# EAGLE design untitled (EAGLE 7.5.0)
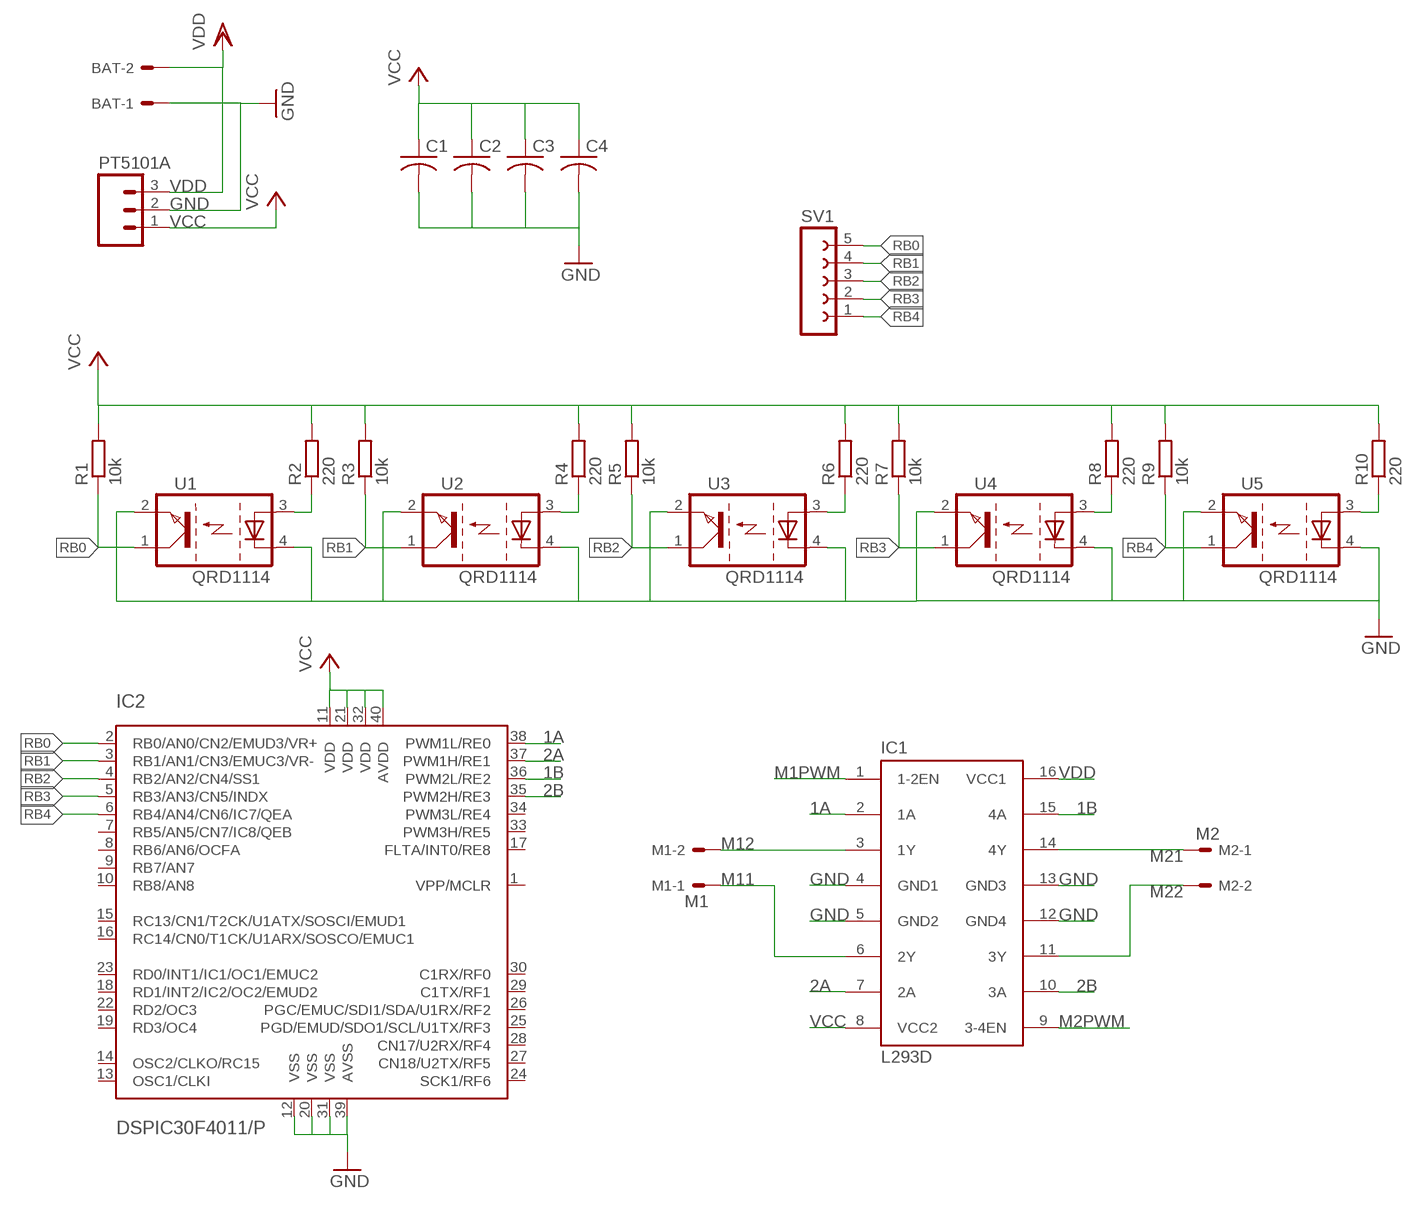
[diagram p0: schematic, sheet 1]

## Parts
BAT  22-27-2021-02  [6410-02]
C1  C-US025-024X044  [C025-024X044]
C2  C-US025-024X044  [C025-024X044]
C3  C-US025-024X044  [C025-024X044]
C4  C-US025-024X044  [C025-024X044]
IC1  L293D  [DIL16]
IC2  DSPIC30F4011/P  [DIL40]
M1  M1  22-27-2021-02  [6410-02]
M2  M2  22-27-2021-02  [6410-02]
PT5101A  M03  [03P]
R1  10k  R-EU_0204/5  [0204/5]
R2  220  R-EU_0204/5  [0204/5]
R3  10k  R-EU_0204/5  [0204/5]
R4  220  R-EU_0204/5  [0204/5]
R5  10k  R-EU_0204/5  [0204/5]
R6  220  R-EU_0204/5  [0204/5]
R7  10k  R-EU_0204/5  [0204/5]
R8  220  R-EU_0204/5  [0204/5]
R9  10k  R-EU_0204/5  [0204/5]
R10  220  R-EU_0204/5  [0204/5]
SV1  FE05-1  [FE05-1]
U1  QRD1114  [QRD1114]
U2  QRD1114  [QRD1114]
U3  QRD1114  [QRD1114]
U4  QRD1114  [QRD1114]
U5  QRD1114  [QRD1114]

## Nets
1A: IC1.2(1A) IC2.38(PWM1L/RE0)
1B: IC1.15(4A) IC2.36(PWM2L/RE2)
2A: IC1.7(2A) IC2.37(PWM1H/RE1)
2B: IC1.10(3A) IC2.35(PWM2H/RE3)
GND: BAT.1 C1.2 C2.2 C3.2 C4.2 IC1.4(GND1) IC1.5(GND2) IC1.12(GND4) IC1.13(GND3) IC2.12(VSS) IC2.20(VSS) IC2.31(VSS) IC2.39(AVSS) PT5101A.2 U1.2 U1.4 U2.2 U2.4 U3.2 U3.4 U4.2 U4.4 U5.2 U5.4
M1PWM: IC1.1(1-2EN)
M2PWM: IC1.9(3-4EN)
M11: IC1.6(2Y) M1.1
M12: IC1.3(1Y) M1.2
M21: IC1.14(4Y) M2.1
M22: IC1.11(3Y) M2.2
N$2: R2.1 U1.3
N$4: R4.1 U2.3
N$6: R10.1 U5.3
N$7: R6.1 U3.3
N$8: R8.1 U4.3
RB0: IC2.2(RB0/AN0/CN2/EMUD3/VR+) R1.1 SV1.5 U1.1
RB1: IC2.3(RB1/AN1/CN3/EMUC3/VR-) R3.1 SV1.4 U2.1
RB2: IC2.4(RB2/AN2/CN4/SS1) R5.1 SV1.3 U3.1
RB3: IC2.5(RB3/AN3/CN5/INDX) R7.1 SV1.2 U4.1
RB4: IC2.6(RB4/AN4/CN6/IC7/QEA) R9.1 SV1.1 U5.1
VCC: C1.1 C2.1 C3.1 C4.1 IC1.8(VCC2) IC2.11(VDD) IC2.21(VDD) IC2.32(VDD) IC2.40(AVDD) PT5101A.1 R1.2 R2.2 R3.2 R4.2 R5.2 R6.2 R7.2 R8.2 R9.2 R10.2
VDD: BAT.2 IC1.16(VCC1) PT5101A.3
Unconnected: IC2.1(VPP/MCLR) IC2.7(RB5/AN5/CN7/IC8/QEB) IC2.8(RB6/AN6/OCFA) IC2.9(RB7/AN7) IC2.10(RB8/AN8) IC2.13(OSC1/CLKI) IC2.14(OSC2/CLKO/RC15) IC2.15(RC13/CN1/T2CK/U1ATX/SOSCI/EMUD1) IC2.16(RC14/CN0/T1CK/U1ARX/SOSCO/EMUC1) IC2.17(FLTA/INT0/RE8) IC2.18(RD1/INT2/IC2/OC2/EMUD2) IC2.19(RD3/OC4) IC2.22(RD2/OC3) IC2.23(RD0/INT1/IC1/OC1/EMUC2) IC2.24(SCK1/RF6) IC2.25(PGD/EMUD/SDO1/SCL/U1TX/RF3) IC2.26(PGC/EMUC/SDI1/SDA/U1RX/RF2) IC2.27(CN18/U2TX/RF5) IC2.28(CN17/U2RX/RF4) IC2.29(C1TX/RF1) IC2.30(C1RX/RF0) IC2.33(PWM3H/RE5) IC2.34(PWM3L/RE4)

## Library data of the parts
BAT M1 M2 = con-molex:22-?-02: CONNECTOR wire to board 2.54 mm (.1 inch) pitch header; OC_FARNELL: unknown; OC_NEWARK: unknown
C1-C4 = rcl:C-US: CAPACITOR, American symbol
IC1 = st-microelectronics:L293D: PUSH-PULL 4 CHANNEL DRIVER; MPN: L293D; OC_FARNELL: 9589619; OC_NEWARK: 56P8249
IC2 = microchip-dspic:DSPIC30F4011: dsPIC Motion Controller DSC
PT5101A = con-amp-quick:M03: AMP QUICK CONNECTOR; OC_FARNELL: unknown; OC_NEWARK: unknown
R1-R10 = resistor:R-EU_: RESISTOR, European symbol
SV1 = con-lsta:FE05-1: FEMALE HEADER; OC_FARNELL: unknown; OC_NEWARK: unknown
U1-U5 = EYR_Sensores:QRD1114: Sensor infrarrojo QRD1114

## Board
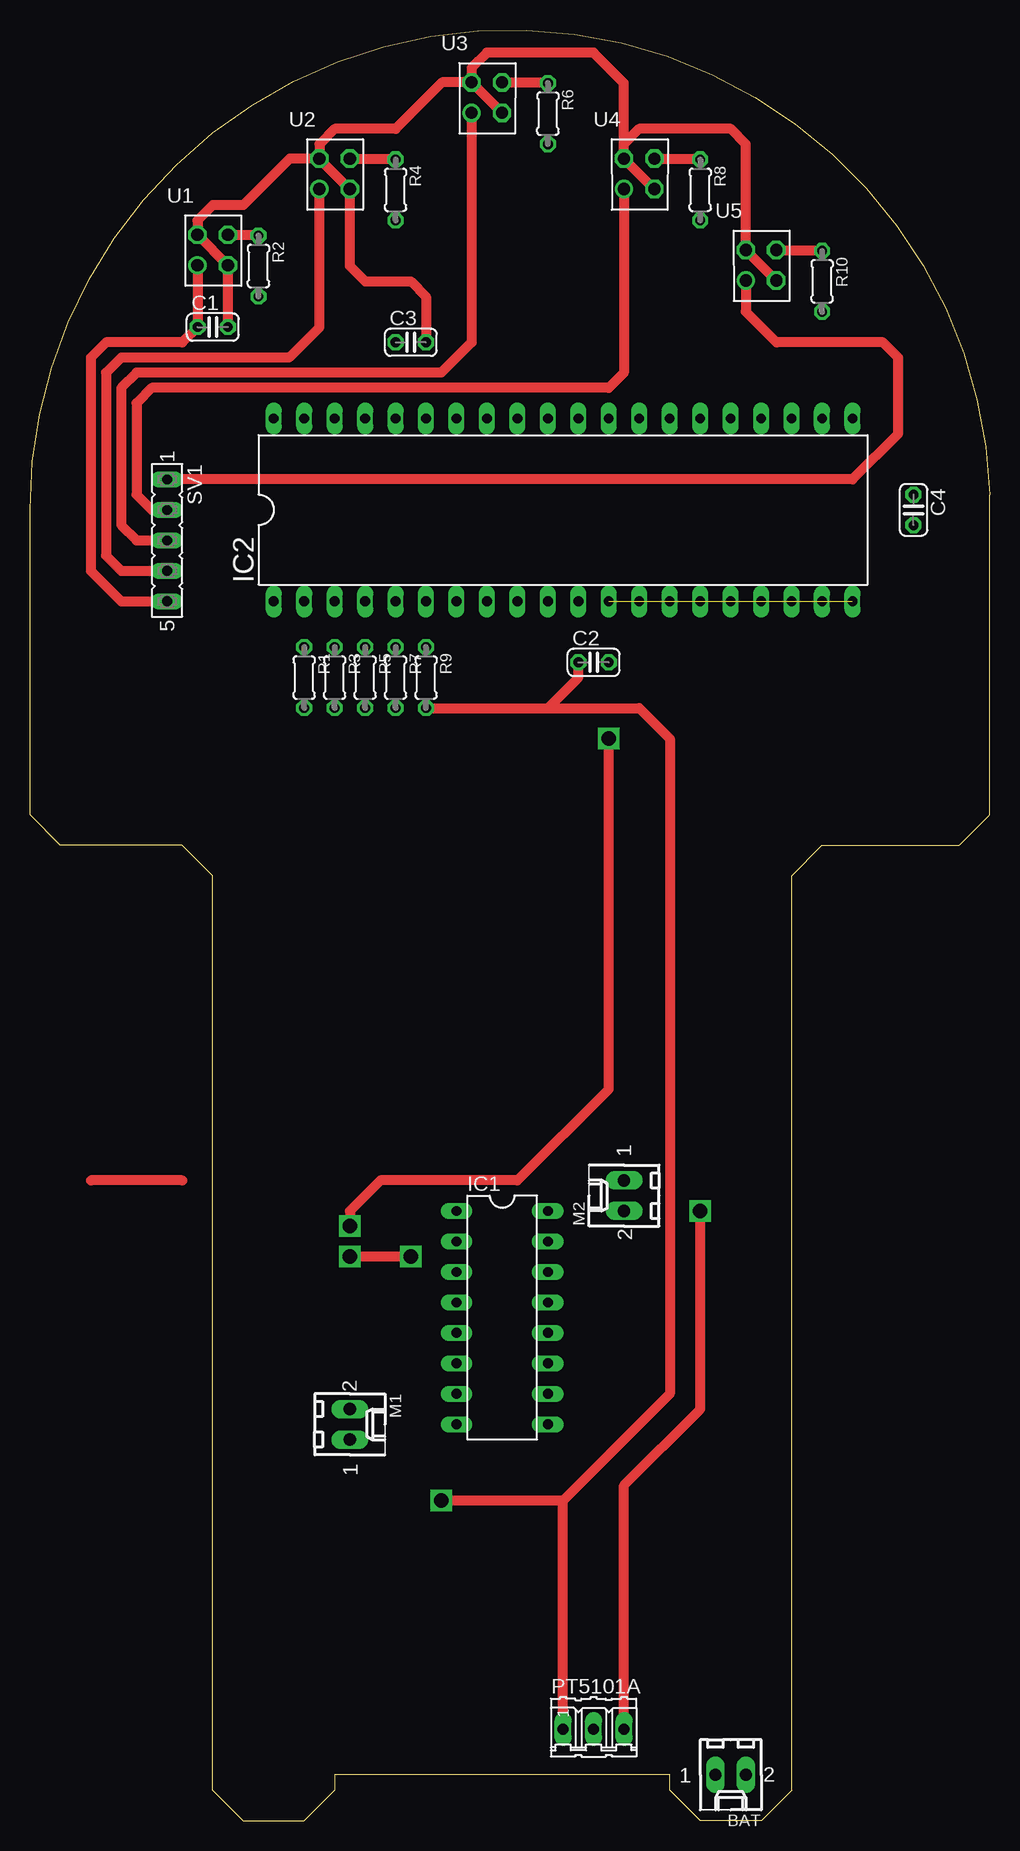
[diagram p1: board, top side]
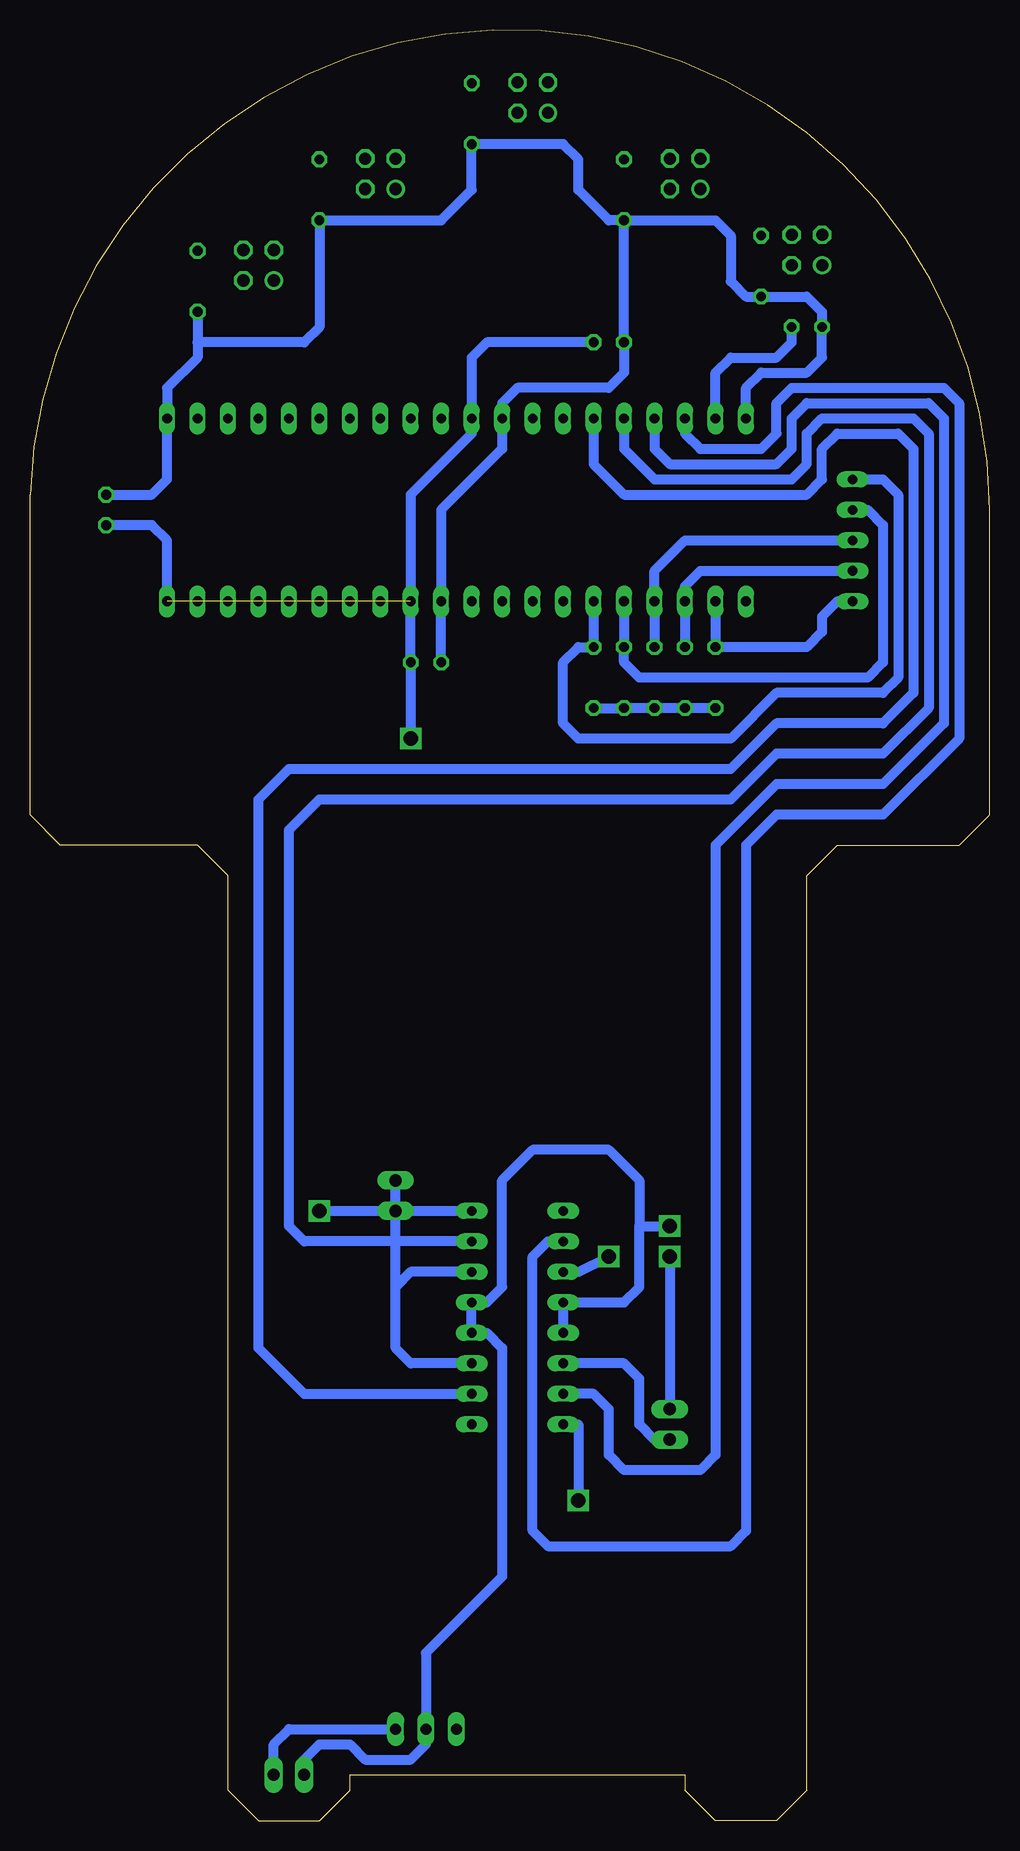
[diagram p2: board, bottom side, seen from below]

Size 80.01 x 149.21 mm. Coordinates in mm from the lower left corner, seen from the top.
Outline: 63.5,2.54 63.5,78.74 66.04,81.28 77.47,81.28 80.01,83.82 80.01,110.49 arc178 0,109.22 0,83.82 2.54,81.28 12.7,81.28 15.24,78.74 15.24,2.54 17.78,0 22.86,0 25.4,2.54 25.4,3.81 53.34,3.81 53.34,2.54 55.88,0 60.96,0 63.5,2.54
Copper layers (1*16): Top 0.035mm / dielectric 1.5mm / Bottom 0.035mm
Design rules "default": minimum track width 10mil, minimum drill 24mil, track to track 8mil, track to pad 8mil, pad to pad 8mil, via to via 8mil, smd to smd 8mil, copper to edge 40mil, drill to drill 8mil, minimum pad ring 10mil, minimum via ring 8mil, stop-mask expansion 4mil, vias tented up to drill 0mil, thermal gap 10mil

### Footprints (pad centres in the part's own frame; a part is rotated, then mirrored left to right if it is on the bottom)
6410-02 = drill 1.016 long: 1 1.27,0; 2 -1.27,0
C025-024X044 = drill 0.813 octagon: 1 -1.27,0; 2 1.27,0
DIL16 = drill 0.813 long: 1 -8.89,-3.81; 2 -6.35,-3.81; 3 -3.81,-3.81; 4 -1.27,-3.81; 5 1.27,-3.81; 6 3.81,-3.81; 7 6.35,-3.81; 8 8.89,-3.81; 9 8.89,3.81; 10 6.35,3.81; 11 3.81,3.81; 12 1.27,3.81; 13 -1.27,3.81; 14 -3.81,3.81; 15 -6.35,3.81; 16 -8.89,3.81
DIL40 = drill 0.813 long: 1 -24.13,-7.62; 2 -21.59,-7.62; 3 -19.05,-7.62; 4 -16.51,-7.62; 5 -13.97,-7.62; 6 -11.43,-7.62; 7 -8.89,-7.62; 8 -6.35,-7.62; 9 -3.81,-7.62; 10 -1.27,-7.62; 11 1.27,-7.62; 12 3.81,-7.62; 13 6.35,-7.62; 14 8.89,-7.62; 15 11.43,-7.62; 16 13.97,-7.62; 17 16.51,-7.62; 18 19.05,-7.62; 19 21.59,-7.62; 20 24.13,-7.62; 21 24.13,7.62; 22 21.59,7.62; 23 19.05,7.62; 24 16.51,7.62; 25 13.97,7.62; 26 11.43,7.62; 27 8.89,7.62; 28 6.35,7.62; 29 3.81,7.62; 30 1.27,7.62; 31 -1.27,7.62; 32 -3.81,7.62; 33 -6.35,7.62; 34 -8.89,7.62; 35 -11.43,7.62; 36 -13.97,7.62; 37 -16.51,7.62; 38 -19.05,7.62; 39 -21.59,7.62; 40 -24.13,7.62
03P = drill 0.914 long: 1 -2.54,0; 2 0,0; 3 2.54,0
0204/5 = drill 0.813 octagon: 1 -2.54,0; 2 2.54,0
FE05-1 = drill 0.813 long: 1 -5.08,0; 2 -2.54,0; 3 0,0; 4 2.54,0; 5 5.08,0
QRD1114 = drill 1.016: 1 -1.28,-1.205 | drill 1.016 octagon: 2 -1.28,1.335; 3 1.26,1.335; 4 1.26,-1.205

### Placement (x,y rotation side)
BAT  58.42,3.81 180 top
C1  15.24,124.46 0 top
C2  46.99,96.52 0 top
C3  31.75,123.19 0 top
C4  73.66,109.22 270 top
IC1  39.37,41.91 270 top
IC2  44.45,109.22 0 top
M1  26.67,33.02 270 top
M2  49.53,52.07 90 top
PT5101A  46.99,7.62 0 top
R1  22.86,95.25 270 top
R2  19.05,129.54 270 top
R3  25.4,95.25 270 top
R4  30.48,135.89 270 top
R5  27.94,95.25 270 top
R6  43.18,142.24 270 top
R7  30.48,95.25 270 top
R8  55.88,135.89 270 top
R9  33.02,95.25 270 top
R10  66.04,128.27 270 top
SV1  11.43,106.68 270 top
U1  15.24,130.81 0 top
U2  25.4,137.16 0 top
U3  38.1,143.51 0 top
U4  50.8,137.16 0 top
U5  60.96,129.54 0 top

### Tracks (layer width: path | path; a pad name or v marks a point on that pad's centre or on a via)
1A
  Bottom 0.813: IC2.38 25.4,115.57 24.13,114.3 19.05,114.3 17.78,115.57 17.78,118.11 16.51,119.38 3.81,119.38 2.54,118.11 2.54,90.17 8.89,83.82 17.78,83.82 20.32,81.28 20.32,24.13 21.59,22.86 36.83,22.86 38.1,24.13 38.1,46.99 36.83,48.26 IC1.2
1B
  Bottom 0.813: IC2.36 30.48,114.3 27.94,111.76 16.51,111.76 15.24,113.03 15.24,115.57 13.97,116.84 6.35,116.84 5.08,115.57 5.08,92.71 8.89,88.9 17.78,88.9 21.59,85.09 55.88,85.09 58.42,82.55 58.42,49.53 57.15,48.26 IC1.15
2A
  Bottom 0.813: IC2.37 27.94,114.3 26.67,113.03 17.78,113.03 16.51,114.3 16.51,116.84 15.24,118.11 5.08,118.11 3.81,116.84 3.81,91.44 8.89,86.36 17.78,86.36 22.86,81.28 22.86,30.48 24.13,29.21 30.48,29.21 31.75,30.48 31.75,34.29 33.02,35.56 IC1.7
2B
  Bottom 0.813: IC2.35 33.02,113.03 30.48,110.49 15.24,110.49 13.97,111.76 13.97,114.3 12.7,115.57 7.62,115.57 6.35,114.3 6.35,93.98 8.89,91.44 17.78,91.44 21.59,87.63 58.42,87.63 60.96,85.09 60.96,39.37 57.15,35.56 IC1.10
GND  (via drill 1.2)  (1 unrouted)
  Top 0.813: U2.2 21.66,138.5 17.78,134.62 15.24,134.62 13.97,133.35 13.97,132.16 | 13.97,132.16 U1.2 | 13.97,132.16 U1.2 U1.4 C1.2 | U2.2 U2.4 26.66,129.55 27.94,128.27 31.75,128.27 33.02,127 C3.2 | U3.2 34.35,144.84 30.48,140.97 25.4,140.97 24.13,139.7 24.13,138.5 U2.2 | U3.2 U3.4 | 49.52,139.7 U4.2 U4.4 | 49.52,139.7 49.52,144.79 46.99,147.32 38.1,147.32 36.83,146.05 36.83,144.85 U3.2 | 49.52,139.7 50.79,140.97 58.42,140.97 59.68,139.71 U5.2 U5.4 | v48.26,90.17 48.26,60.96 40.64,53.34 29.21,53.34 26.67,50.8 v26.67,49.53
  Bottom 0.813: BAT.1 57.15,5.08 55.88,6.35 53.34,6.35 52.07,5.08 48.26,5.08 46.99,6.35 PT5101A.2 46.99,13.97 40.64,20.32 40.64,39.37 41.91,40.64 IC1.12 IC1.13 41.91,43.18 40.64,44.45 40.64,53.34 38.1,55.88 31.75,55.88 29.21,53.34 29.21,49.53 | IC1.5 IC1.4 30.48,43.18 29.21,44.45 29.21,49.53 | C3.2 41.91,123.19 43.18,121.92 IC2.31 43.18,115.57 48.26,110.49 IC2.12 C2.2 v48.26,90.17 | IC2.39 22.86,120.65 21.59,121.92 17.78,121.92 16.51,123.19 C1.2 | 29.21,49.53 v26.67,49.53 | IC2.20 68.58,106.68 69.85,107.95 C4.2
M11
  Bottom 0.813: M1.1 27.94,31.75 29.21,33.02 29.21,36.83 30.48,38.1 IC1.6
M12  (via drill 1.2)
  Top 0.813: v31.75,46.99 v26.67,46.99
  Bottom 0.813: IC1.3 34.29,45.72 v31.75,46.99 | v26.67,46.99 M1.2
M21
  Bottom 0.813: IC1.14 48.26,45.72 49.53,44.45 M2.1
M22
  Bottom 0.813: IC1.11 48.26,38.1 49.53,39.37 M2.2
N$1
  Top 0.813: 12.7,53.34 5.08,53.34
N$2
  Top 0.813: U1.3 19.05,132.15 R2.1
N$4
  Top 0.813: U2.3 30.48,138.5 R4.1
N$6
  Top 0.813: U5.3 66.04,130.88 R10.1
N$7
  Top 0.813: U3.3 43.18,144.84 R6.1
N$8
  Top 0.813: U4.3 55.88,138.5 R8.1
RB0
  Top 0.813: U1.1 13.96,124.45 12.7,123.19 6.35,123.19 5.08,121.92 5.08,104.14 7.62,101.6 SV1.5
  Bottom 0.813: IC2.2 R1.1 15.24,97.79 13.97,99.06 13.97,100.33 12.7,101.6 SV1.5
RB1
  Top 0.813: U2.1 24.12,124.47 24.13,124.46 21.59,121.92 7.62,121.92 6.35,120.65 6.35,105.41 7.62,104.14 SV1.4
  Bottom 0.813: R3.1 IC2.3 25.4,102.87 24.13,104.14 SV1.4
RB2
  Top 0.813: U3.1 36.82,123.18 34.29,120.65 8.89,120.65 7.62,119.38 7.62,107.95 8.89,106.68 SV1.3
  Bottom 0.813: R5.1 IC2.4 27.94,104.14 25.4,106.68 SV1.3
RB3
  Top 0.813: U4.1 49.52,120.64 48.26,119.38 10.16,119.38 8.89,118.11 8.89,110.49 10.16,109.22 SV1.2
  Bottom 0.813: IC2.5 R7.1 30.48,96.52 29.21,95.25 10.16,95.25 8.89,96.52 8.89,107.95 10.16,109.22 SV1.2
RB4
  Top 0.813: U5.1 59.68,125.74 62.23,123.19 71.12,123.19 72.39,121.92 72.39,115.57 68.58,111.76 SV1.1
  Bottom 0.813: IC2.6 R9.1 34.29,97.79 35.56,96.52 35.56,91.44 34.29,90.17 21.59,90.17 17.78,93.98 8.89,93.98 7.62,95.25 7.62,110.49 8.89,111.76 SV1.1
VCC  (via drill 1.2)
  Top 0.813: R9.2 43.18,92.71 | 43.18,92.71 45.72,95.25 C2.1 | PT5101A.1 44.45,26.67 | 44.45,26.67 53.34,35.56 53.34,90.17 50.8,92.71 43.18,92.71 | 44.45,26.67 v34.29,26.67
  Bottom 0.813: R1.2 R3.2 R5.2 R7.2 R9.2 | C2.1 IC2.11 45.72,109.22 40.64,114.3 IC2.32 40.64,118.11 39.37,119.38 31.75,119.38 30.48,120.65 C3.1 R4.2 | C4.1 69.85,110.49 68.58,111.76 IC2.21 68.58,119.38 66.04,121.92 66.04,123.19 | R4.2 31.75,133.35 34.29,135.89 34.29,138.43 35.56,139.7 R6.2 43.18,135.89 45.72,133.35 R8.2 55.88,124.46 57.15,123.19 66.04,123.19 | R4.2 22.86,133.35 21.59,132.08 21.59,128.27 20.32,127 R2.2 15.24,127 13.97,125.73 C1.1 13.97,121.92 15.24,120.65 19.05,120.65 20.32,119.38 IC2.40 | R10.2 66.04,123.19 | IC1.8 34.29,33.02 v34.29,26.67
VDD  (via drill 1.2)
  Top 0.813: PT5101A.3 49.53,27.94 55.88,34.29 v55.88,50.8
  Bottom 0.813: BAT.2 59.69,6.35 58.42,7.62 PT5101A.3 | v55.88,50.8 IC1.16